# EAGLE design TrinketCarV2 (EAGLE 7.7.0)
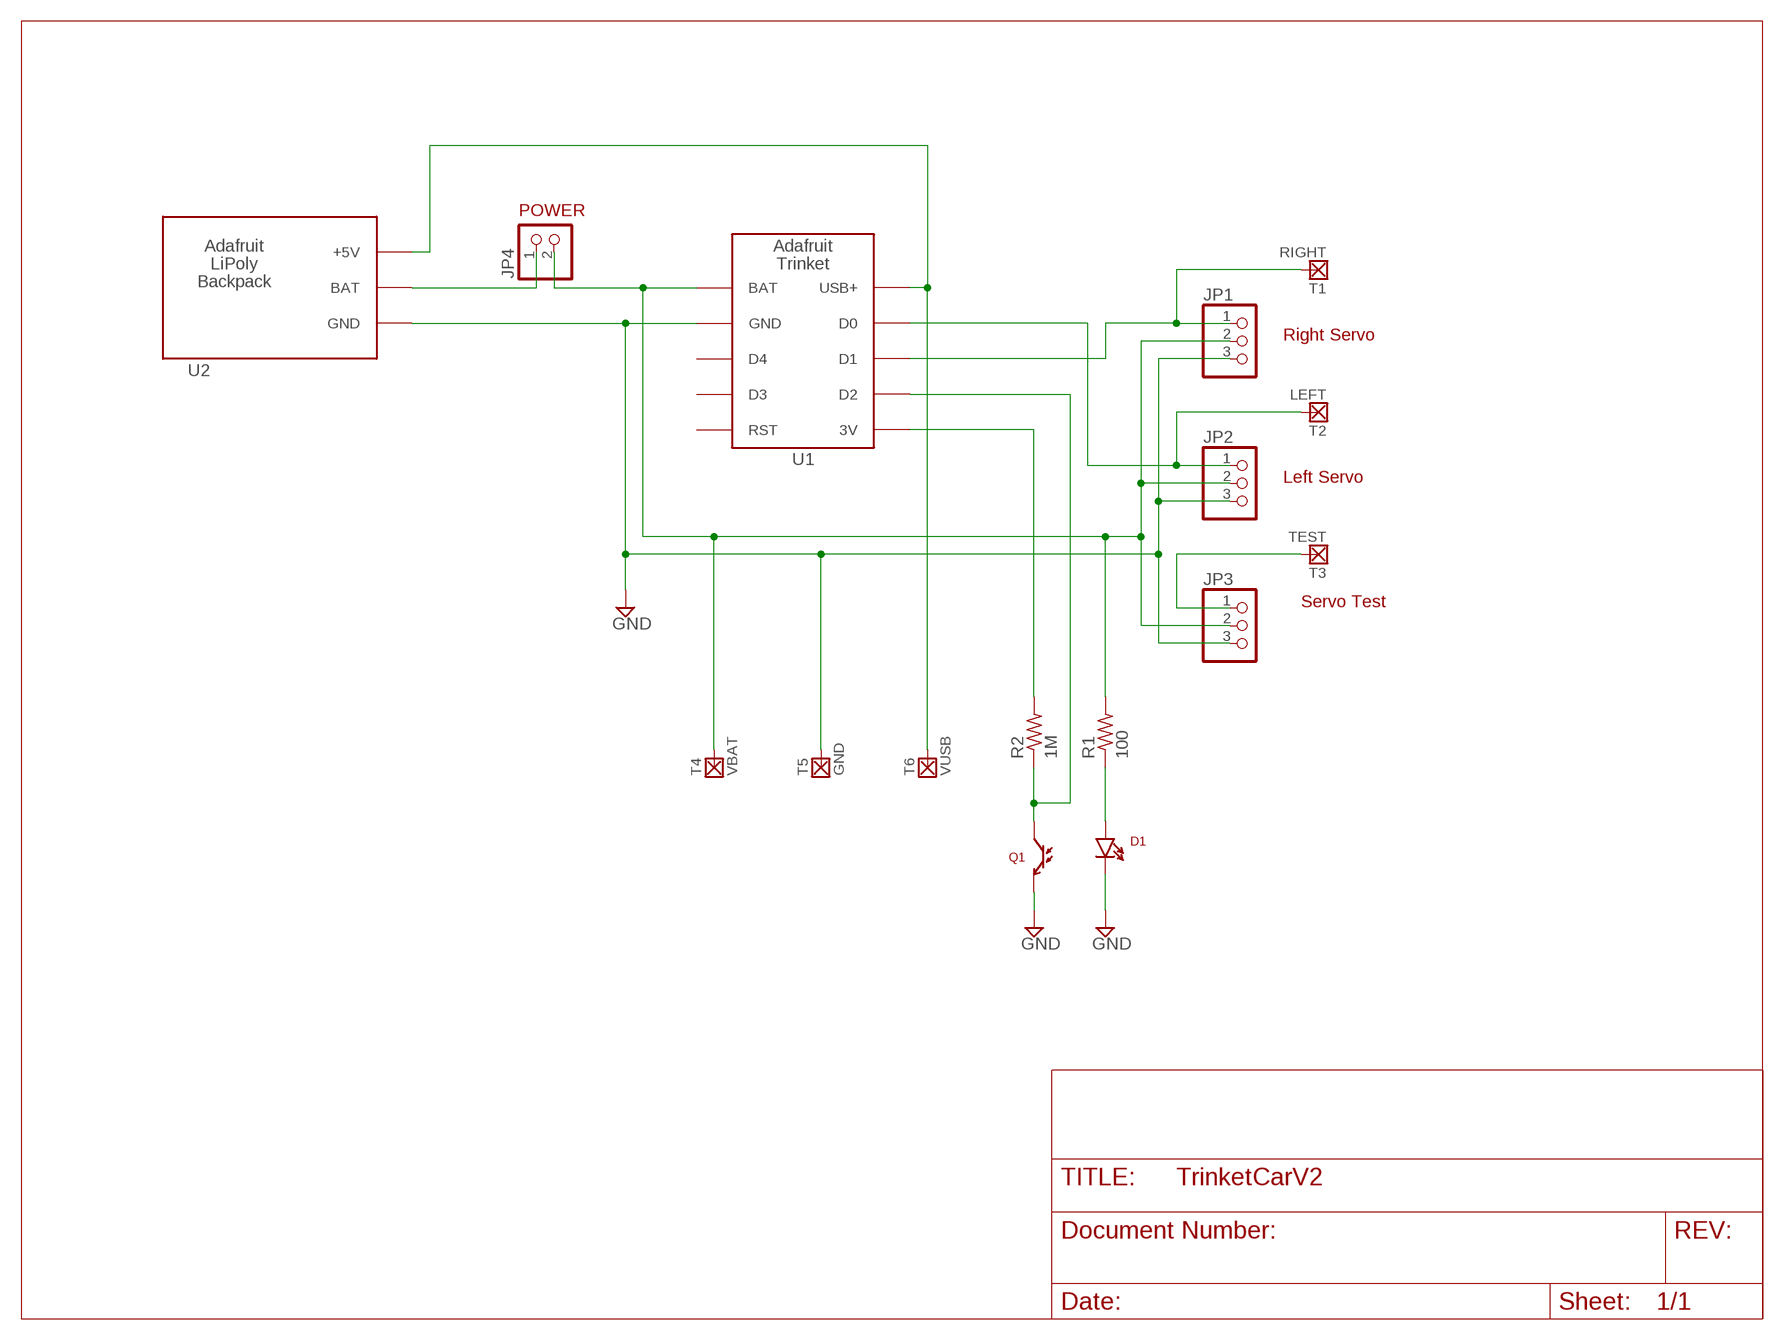
[diagram p0: schematic, sheet 1]

## Parts
D1  LTE-302  [LTE-302]
JP1  PINHD-1X3  [1X03]
JP2  PINHD-1X3  [1X03]
JP3  PINHD-1X3  [1X03]
JP4  PINHD-1X2  [1X02]
Q1  LTR-301  [LTR-301]
R1  100  R-US_0207/12  [0207/12]
R2  1M  R-US_0207/12  [0207/12]
T1  RIGHT  TERMPOSTS  [TERMPAD-SMALL]
T2  LEFT  TERMPOSTS  [TERMPAD-SMALL]
T3  TEST  TERMPOSTS  [TERMPAD-SMALL]
T4  VBAT  TERMPOSTS  [TERMPAD-SMALL]
T5  GND  TERMPOSTS  [TERMPAD-SMALL]
T6  VUSB  TERMPOSTS  [TERMPAD-SMALL]
U1  ADAFRUIT_TRINKET  [TRINKITMINI]
U2  LIPOLY_BACKPACK  [TRINKET_LIPO_BACKPACK]

## Nets
GND: D1.C JP1.3 JP2.3 JP3.3 Q1.E T5.P$1(P) U1.P$2(GND) U2.P$2(GND)
N$1: R2.2 U1.P$6(3V)
N$2: JP4.1 U2.P$1(BAT)
N$3: D1.A R1.1
N$4: JP1.1 T1.P$1(P) U1.P$8(D1)
N$5: JP2.1 T2.P$1(P) U1.P$9(D0)
N$6: Q1.C R2.1 U1.P$7(D2)
N$7: JP3.1 T3.P$1(P)
VBAT: JP1.2 JP2.2 JP3.2 JP4.2 R1.2 T4.P$1(P) U1.P$1(BAT)
VUSB: T6.P$1(P) U1.P$10(USB+) U2.P$3(+5V)
Unconnected: U1.P$3(D4) U1.P$4(D3) U1.P$5(RST)

## Notes on the sheet
- POWER
- Right Servo
- Left Servo
- Servo Test

## Library data of the parts
D1 = SparkFun-LED:LTE-302: Through-hole side-firing 940nm IR LED
JP1-JP3 = pinhead:PINHD-1X3: PIN HEADER
JP4 = pinhead:PINHD-1X2: PIN HEADER
Q1 = SparkFun-Sensors:LTR-301: Through-hole side-receiving IR phototransistor
R1 R2 = rcl:R-US_: RESISTOR, American symbol
T1-T6 = mystuff:TERMPOST
U1 = Adafruit_Boards:ADAFRUIT_TRINKET
U2 = Adafruit_Boards:LIPOLY_BACKPACK: Adafruit Lipoly charger backpack

## Board
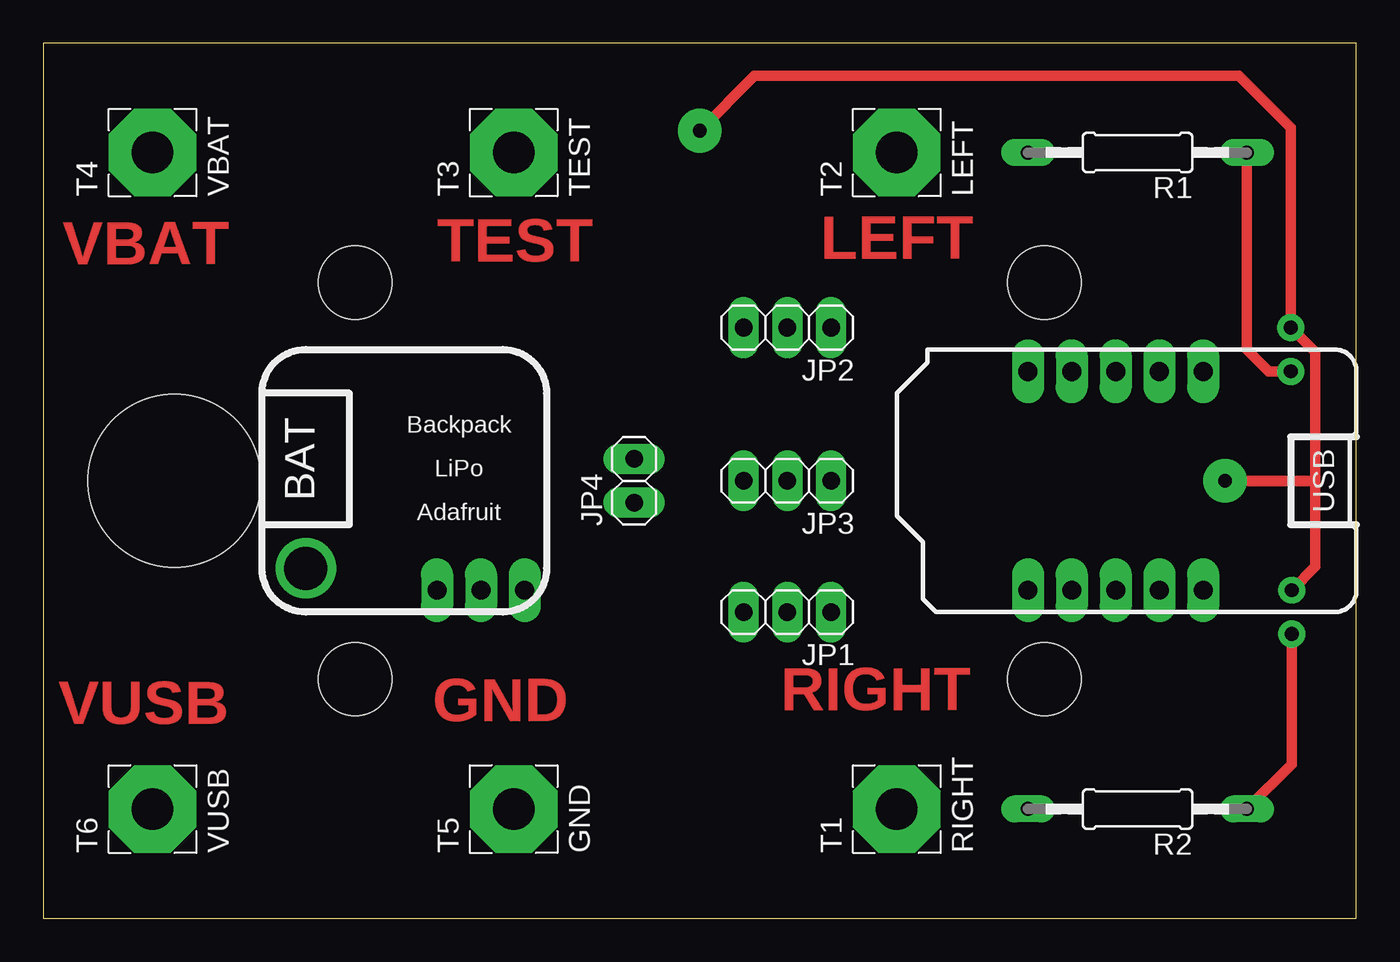
[diagram p1: board, top side]
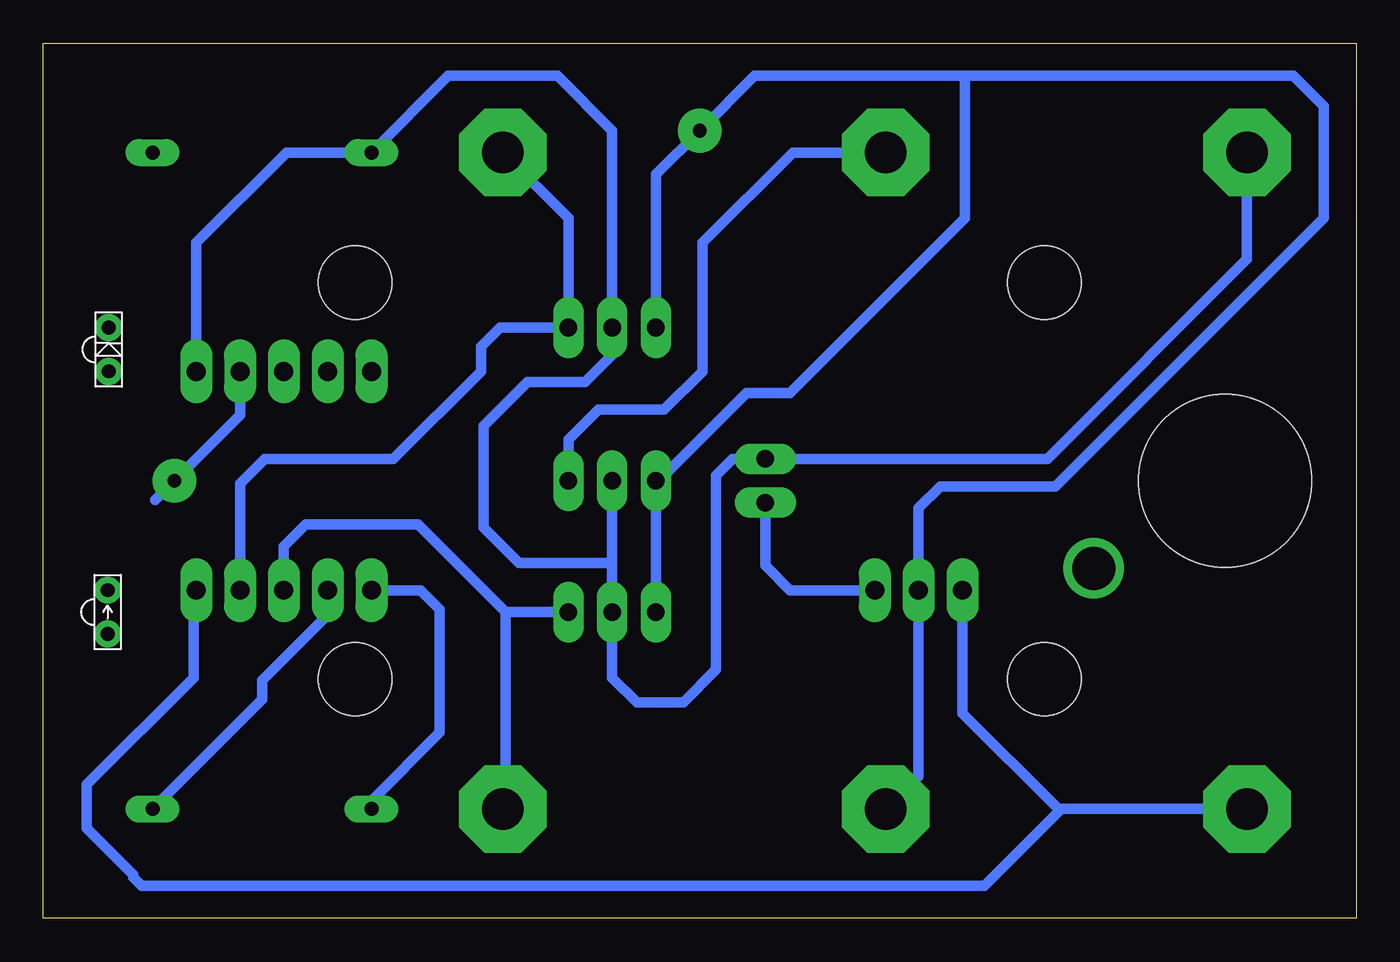
[diagram p2: board, bottom side, seen from below]

Size 76.2 x 50.8 mm. Coordinates in mm from the lower left corner, seen from the top.
Outline: 76.2,0 76.2,50.8 0,50.8 0,0 76.2,0
Copper layers (1*16): Top 0.035mm / dielectric 1.5mm / Bottom 0.035mm
Design rules "default *": minimum track width 24mil, minimum drill 31mil, track to track 10mil, track to pad 10mil, pad to pad 8mil, via to via 8mil, smd to smd 8mil, copper to edge 40mil, drill to drill 8mil, minimum pad ring 15mil, minimum via ring 8mil, stop-mask expansion 4mil, vias tented up to drill 0mil, thermal gap 10mil
Holes 4.24 mm at 18.11,13.89 18.11,36.91 58.09,36.91 58.09,13.89
Holes 10 mm at 7.62,25.4

### Footprints (pad centres in the part's own frame; a part is rotated, then mirrored left to right if it is on the bottom)
LTE-302 = drill 0.8: A 1.27,0; C -1.27,0
1X03 = drill 1.016 long: 1 -2.54,0; 2 0,0; 3 2.54,0
1X02 = drill 1.016 long: 1 -1.27,0; 2 1.27,0
LTR-301 = drill 0.8: C 1.27,0; E -1.27,0
0207/12 = drill 0.813 long: 1 -6.35,0; 2 6.35,0
TERMPAD-SMALL = drill 2.413 pad 5.08 octagon: P$1 0,0
TRINKITMINI = drill 1.1 long: P$1 -6.35,3.81; P$2 -6.35,1.27; P$3 -6.35,-1.27; P$4 -6.35,-3.81; P$5 -6.35,-6.35; P$6 6.35,-6.35; P$7 6.35,-3.81; P$8 6.35,-1.27; P$9 6.35,1.27; P$10 6.35,3.81
TRINKET_LIPO_BACKPACK = drill 1.1 long: P$1 1.27,13.97; P$2 3.81,13.97; P$3 6.35,13.97 | drill 2.5: P$5 13.97,12.7

### Placement (x,y rotation side)
D1  72.39,33.02 270 bottom
JP1  43.18,17.78 180 top
JP2  43.18,34.29 180 top
JP3  43.18,25.4 180 top
JP4  34.29,25.4 90 top
Q1  72.45,17.78 270 bottom
R1  63.5,44.45 180 top
R2  63.5,6.35 180 top
T1  49.53,6.35 90 top
T2  49.53,44.45 90 top
T3  27.3,44.45 90 top
T4  6.35,44.45 90 top
T5  27.3,6.35 90 top
T6  6.35,6.35 90 top
U1  63.5,25.4 270 top
U2  29.21,33.02 180 top

### Tracks (layer width: path | path; a pad name or v marks a point on that pad's centre or on a via)
GND  (via drill 0.8 pad 2.54)
  Top 0.61: Q1.E 73.82,20.41 73.82,25.56 | 73.82,25.56 73.82,32.86 D1.C 72.39,45.88 69.37,48.9 41.27,48.9 v38.1,45.72 | v68.58,25.4 73.66,25.4 73.82,25.56
  Bottom 0.61: JP1.3 JP3.3 40.48,25.4 35.4,30.48 32.86,30.48 22.7,40.64 22.7,48.9 | T5.P$1 25.4,8.26 U2.P$2 25.4,23.81 24.13,25.08 17.46,25.08 1.91,40.64 1.91,47.15 3.65,48.9 22.7,48.9 | JP2.3 40.64,43.18 v38.1,45.72 34.92,48.9 22.7,48.9 | U1.P$2 64.77,29.21 v68.58,25.4 69.69,24.29
N$1
  Bottom 0.61: R2.2 57.15,6.83 53.18,10.79 53.18,17.94 54.29,19.05 U1.P$6
N$2
  Bottom 0.61: JP4.1 34.29,20.48 32.86,19.05 U2.P$1
N$3
  Top 0.61: D1.A 71.12,31.75 69.85,33.02 R1.1
N$4
  Bottom 0.61: 45.72,17.62 JP1.1 49.37,17.78 | 49.37,17.78 49.37,6.51 T1.P$1 | 49.37,17.78 54.45,22.86 60.96,22.86 62.23,21.59 U1.P$8
N$5
  Bottom 0.61: U1.P$9 64.77,25.24 63.34,26.67 55.88,26.67 50.8,31.75 50.8,33.18 49.69,34.29 JP2.1 45.72,40.64 T2.P$1
N$6
  Top 0.61: Q1.C 72.45,8.95 R2.1
  Bottom 0.61: U1.P$7 59.69,17.62 63.5,13.81 63.5,12.7 R2.1
N$7
  Bottom 0.61: JP3.1 45.72,27.78 43.97,29.53 40.16,29.53 37.94,31.75 37.94,39.21 32.7,44.45 T3.P$1
VBAT
  Bottom 0.61: U1.P$1 67.31,39.21 62.07,44.45 R1.2 52.7,48.9 46.35,48.9 43.18,45.72 JP2.2 43.18,32.7 44.77,31.11 48.1,31.11 50.64,28.57 50.64,22.7 48.58,20.64 43.34,20.64 43.18,20.48 | 43.18,20.48 JP1.2 43.18,13.97 41.75,12.54 39.05,12.54 37.15,14.45 37.15,25.72 36.2,26.67 JP4.2 17.94,26.67 6.35,38.26 T4.P$1 | 43.18,20.48 JP3.2
VUSB
  Bottom 0.61: T6.P$1 17.3,6.35 | U1.P$10 67.31,18.89 67.47,18.73 67.47,13.97 73.66,7.78 73.66,5.24 70.96,2.54 70.96,2.38 70.48,1.91 21.59,1.91 17.3,6.19 17.3,6.35 | U2.P$3 22.86,11.91 17.3,6.35

### Text on the board
Top: TEST | LEFT | VBAT | RIGHT | VUSB | GND